# Altium schematic sheet buttons.SchDoc
size A4
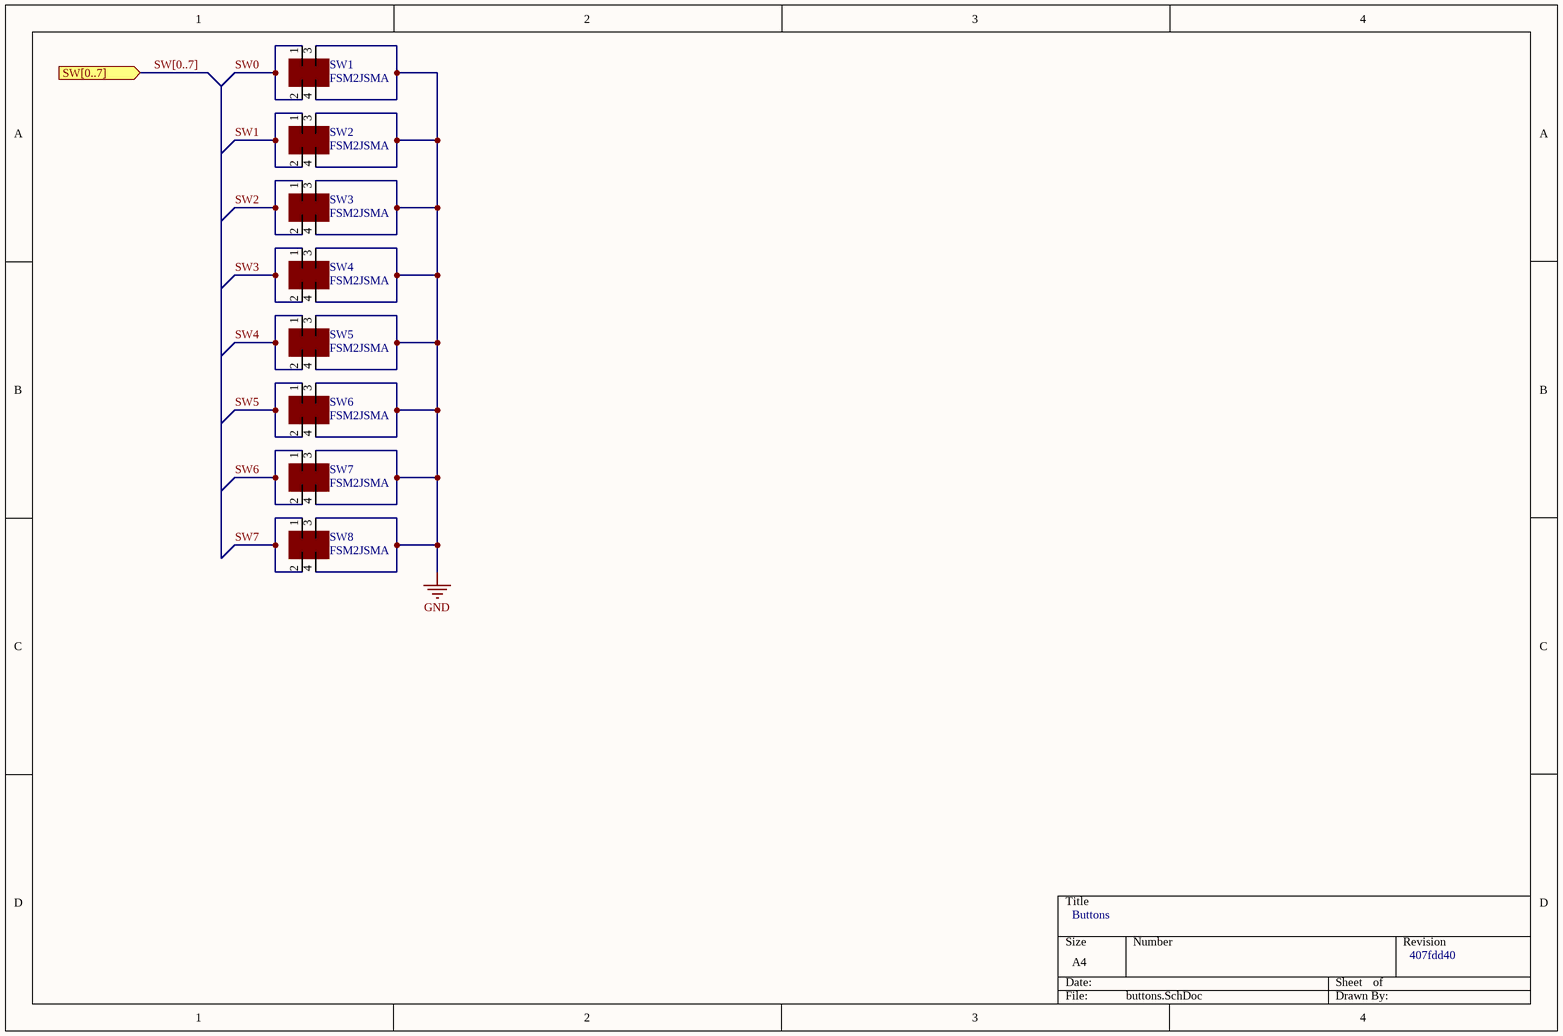
[diagram p0: buttons.SchDoc]

## Parts
SW1  FSM2JSMA  [Button]
SW2  FSM2JSMA  [Button]
SW3  FSM2JSMA  [Button]
SW4  FSM2JSMA  [Button]
SW5  FSM2JSMA  [Button]
SW6  FSM2JSMA  [Button]
SW7  FSM2JSMA  [Button]
SW8  FSM2JSMA  [Button]

## Ports
SW[0..7] (in)

## Nets
GND: SW1.3 SW1.4 SW2.3 SW2.4 SW3.3 SW3.4 SW4.3 SW4.4 SW5.3 SW5.4 SW6.3 SW6.4 SW7.3 SW7.4 SW8.3 SW8.4
SW0: SW1.1 SW1.2
SW1: SW2.1 SW2.2
SW2: SW3.1 SW3.2
SW3: SW4.1 SW4.2
SW4: SW5.1 SW5.2
SW5: SW6.1 SW6.2
SW6: SW7.1 SW7.2
SW7: SW8.1 SW8.2

## Buses and harness runs
bus SW[0..7] = port SW[0..7]

## Notes on the sheet
- Buttons
- 407fdd40

## Library data of the parts
SW1-SW8 = switch-button